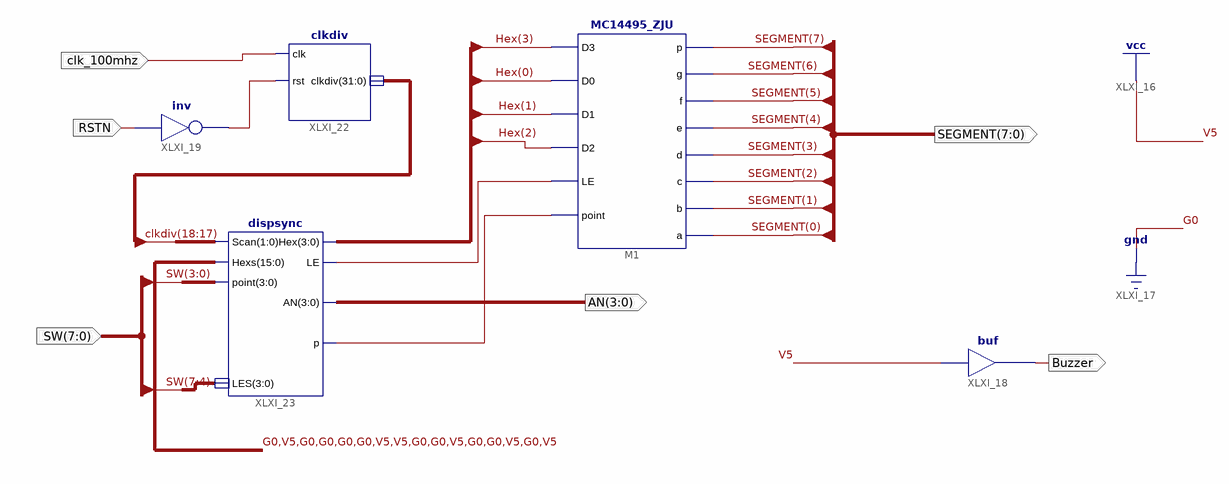
[diagram p0: schematic sheet 1]
// Xilinx ISE schematic Hex427Seg_sch.sch (kintex7) as structural Verilog: 5 symbols, 6 ports
module Hex427Seg_sch (
  input  [7:0] SW,
  input  RSTN,
  input  clk_100mhz,
  output Buzzer,
  output [3:0] AN,
  output [7:0] SEGMENT
);

  wire XLXN_28, XLXN_29, XLXN_36;
  wire [3:0] Hex;
  wire [31:0] clkdiv;

  dispsync XLXI_23 (
    .Scan(clkdiv[18:17]), .Hexs(16'b0100001100100101), .point(SW[3:0]), .LES(SW[7:4]), .p(XLXN_29),
    .LE(XLXN_28), .Hex(Hex), .AN(AN));
  clkdiv XLXI_22 (.clk(clk_100mhz), .rst(XLXN_36), .clkdiv(clkdiv));
  MC14495_ZJU M1 (
    .D3(Hex[3]), .D0(Hex[0]), .D1(Hex[1]), .D2(Hex[2]), .LE(XLXN_28), .point(XLXN_29), .p(SEGMENT[7]),
    .g(SEGMENT[6]), .f(SEGMENT[5]), .e(SEGMENT[4]), .d(SEGMENT[3]), .c(SEGMENT[2]), .b(SEGMENT[1]),
    .a(SEGMENT[0]));
  not XLXI_19 (XLXN_36, RSTN);
  buf XLXI_18 (Buzzer, 1'b1);
endmodule
